# Altium schematic sheet Interface.SchDoc
size A4
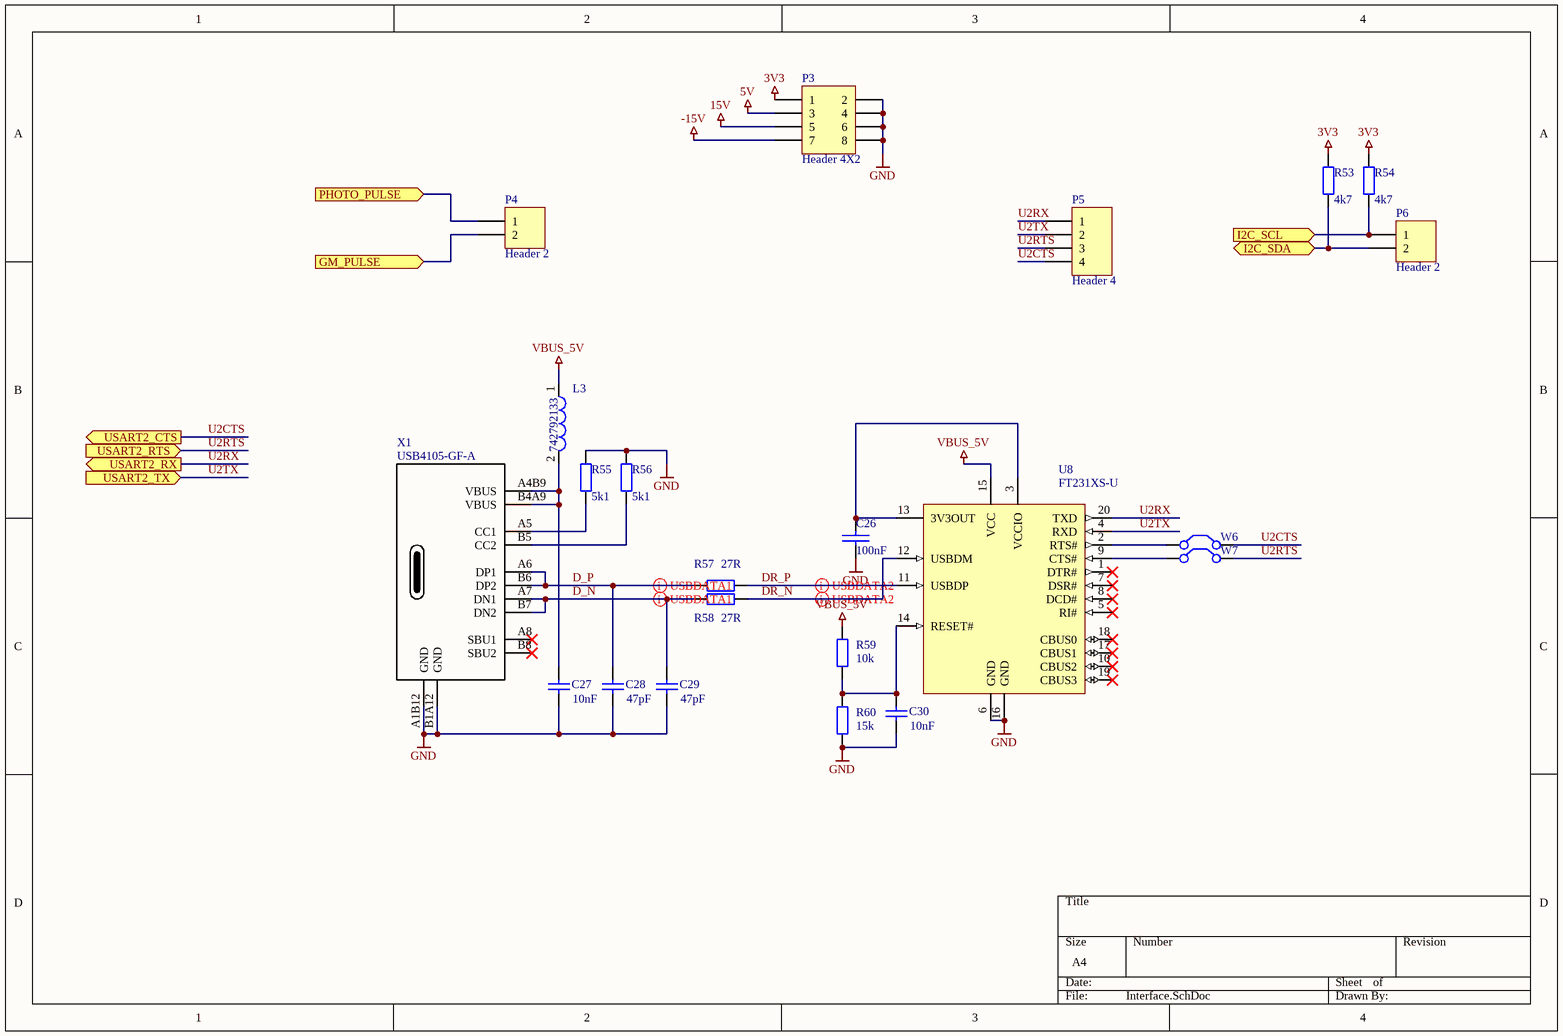
[diagram p0: Interface.SchDoc]

## Parts
C26  100nF  [Cap_0805]
C27  10nF  [6-0805_L]
C28  47pF  [6-0805_L]
C29  47pF  [6-0805_L]
C30  10nF  [Cap_0805]
L3  742792133  [SMD-1206]
P3  Header 4X2  [HDR2X4]
P4  Header 2  [HDR1X2]
P5  Header 4  [HDR1X4]
P6  Header 2  [HDR1X2]
R53  value 4k7  [RES_0805]  (hidden comment: 5k1)
R54  value 4k7  [RES_0805]  (hidden comment: 5k1)
R55  5k1  [RES_0805]
R56  5k1  [RES_0805]
R57  27R  [RES_0805]
R58  27R  [RES_0805]
R59  10k  [RES_0805]
R60  15k  [RES_0805]
U8  FT231XS-U  [SSOP-20_M]
W6  Jumper  [JUMPER]  (value not drawn)
W7  Jumper  [JUMPER]  (value not drawn)
X1  USB4105-GF-A  [GCT_USB4105-GF-A]

## Ports
GM_PULSE (in), I2C_SCL (in), I2C_SDA (bidir), PHOTO_PULSE (in), USART2_CTS (out), USART2_RTS (in), USART2_RX (out), USART2_TX (in)

## Nets
3V3: P3.1 R53.2 R54.2
5V: P3.3
15V: P3.5
-15V: P3.7
GND: C26.2 C27.1 C28.1 C29.1 C30.1 P3.2 P3.4 P3.6 P3.8 R55.2 R56.2 R60.1 U8.6(GND) U8.16(GND) X1.A1B12(GND) X1.B1A12(GND)
VBUS_5V: L3.1 R59.2 U8.15(VCC)
D_N: C29.2 R58.1 X1.A7(DN1) X1.B7(DN2)
D_P: C28.2 R57.1 X1.A6(DP1) X1.B6(DP2)
DR_N: R58.2 U8.12(USBDM)
DR_P: R57.2 U8.11(USBDP)
GM_PULSE: P4.2 ; port GM_PULSE
I2C_SCL: P6.1 R54.1 ; port I2C_SCL
I2C_SDA: P6.2 R53.1 ; port I2C_SDA
PHOTO_PULSE: P4.1 ; port PHOTO_PULSE
U2CTS: P5.4 W6.2(C2) ; port USART2_CTS
U2RTS: P5.3 W7.2(C2) ; port USART2_RTS
U2RX: P5.1 U8.20(TXD) ; port USART2_RX
U2TX: P5.2 U8.4(RXD) ; port USART2_TX
NetC26_1: C26.1 U8.3(VCCIO) U8.13(3V3OUT)
NetC27_2: C27.2 L3.2 X1.A4B9(VBUS) X1.B4A9(VBUS)
NetC30_2: C30.2 R59.1 R60.2 U8.14(RESET#)
NetR55_1: R55.1 X1.A5(CC1)
NetR56_1: R56.1 X1.B5(CC2)
NetU8_2: U8.2(RTS#) W6.1(C1)
NetU8_9: U8.9(CTS#) W7.1(C1)

Not connected (* = marked no-connect by the designer): U8 1(DTR#)* 5(RI#)* 7(DSR#)* 8(DCD#)* 10(CBUS2)* 17(CBUS1)* 18(CBUS0)* 19(CBUS3)*; X1 A8(SBU1)* B8(SBU2)*

## Layout directives
differential pair: D_N, D_P, DR_N, DR_P

## Library data of the parts
C26 = C: SDTSourceLibName: C:\WINDOWS\TEMP\DA.LIB; PCB Footprint: RC0805
C27-C30 = Cap: Capacitor; Published: 8-Jun-2000; LatestRevisionDate: 17-Jul-2002; LatestRevisionNote: Re-released for DXP Platform.; PackageReference: RAD-0.3; Publisher: Altium Limited; PackageDescription: Radial Cap, Thru-Hole; 2 Leads; 0.3 in Pin Spacing
  C27 C30: Value: 10nF
  C28 C29: Value: 47pF
L3 = CMP-0220-00010-1: SMD EMI Suppression Ferrite Bead WE-CBF, Z = 600 Ohm; Impedance: 600 Ohm; ComponentLink1Description: Manufacturer Link; DatasheetVersion: ver 2, Aug-2007; ComponentLink1URL: http://www.we-online.com; PackageDescription: Chip Inductor, 2-Leads, Body 3.2 x 1.6 mm; ComponentLink2URL: http://www.we-online.de/katalog/media/pdf/742792133.pdf; PackageVersion: 2007; PackageReference: SMD-1206; ComponentLink2Description: Datasheet
P3 = Header 4X2: Header, 4-Pin, Dual row; LatestRevisionDate: 17-Jul-2002; LatestRevisionNote: Re-released for DXP Platform.; Publisher: Altium Limited
P4 P6 = Header 2: Header, 2-Pin; LatestRevisionDate: 17-Jul-2002; LatestRevisionNote: Re-released for DXP Platform.; Publisher: Altium Limited
P5 = Header 4: Header, 4-Pin; LatestRevisionDate: 17-Jul-2002; LatestRevisionNote: Re-released for DXP Platform.; Publisher: Altium Limited
R53-R60 = Res2: Res 0805; Published: 8-Jun-2000; LatestRevisionDate: 17-Jul-2002; LatestRevisionNote: Re-released for DXP Platform.; PackageReference: AXIAL-0.4; Publisher: Altium Limited; PackageDescription: Axial Device, Thru-Hole; 2 Leads; 0.4 in Pin Spacing
  R55 R56: Value: 5k1
  R57 R58: Value: 27R
  R59: Value: 10k
  R60: Value: 15k
U8 = CMP-0248-00015-2: USB to Full-Handshake UART Interface Chip, UHCI/OHCI/EHCI Compatible, USB 2.0 Compatible, -40 to +85 degC, 20-Pin SSOP, Pb-Free, Tube; Manufacturer: FTDI; PackageDescription: 20-Pin Small Outline Package, 8.6 x 3.9 mm Body, 0.635 mm Pitch; ComponentLink2Description: Datasheet; DatasheetVersion: ver 1.2, Feb-2013; PackageReference: SSOP-20; ComponentLink3URL: www.ftdichip.com/Products/ICs/FT231X.html; ComponentLink2URL: http://www.ftdichip.com/Support/Documents/DataSheets/ICs/DS_FT231X.pdf; PartNumber: FT231XS-U; ComponentLink3Description: FT231X Product Page; ComponentLink1URL: http://www.ftdichip.com/; Code_JEDEC: MO-137-AD; ComponentLink1Description: Manufacturer URL; RevisionNote: DatasheetVersion updated to 1.2 Feb-2013; PackageVersion: Feb-13
W6 W7 = Jumper: Jumper Wire; Published: 24-Mar-1999; LatestRevisionDate: 17-Jul-2002; LatestRevisionNote: Re-released for DXP Platform.; PackageReference: RAD-0.2; Publisher: Altium Limited; PackageDescription: Radial Cap, Thru-Hole; 2 Leads; 0.2 in Pin Spacing
X1 = USB-C Type 2.0: USB4105-GF-A USB connector; ComponentLink1Description: LCSC  C319148; ComponentLink1URL: https://lcsc.com/product-detail/USB-Connectors_XKB-Connectivity-U262-161N-4BVC11_C319148.html; Supplier 1: LCSC; Supplier Part Number 1: C319148